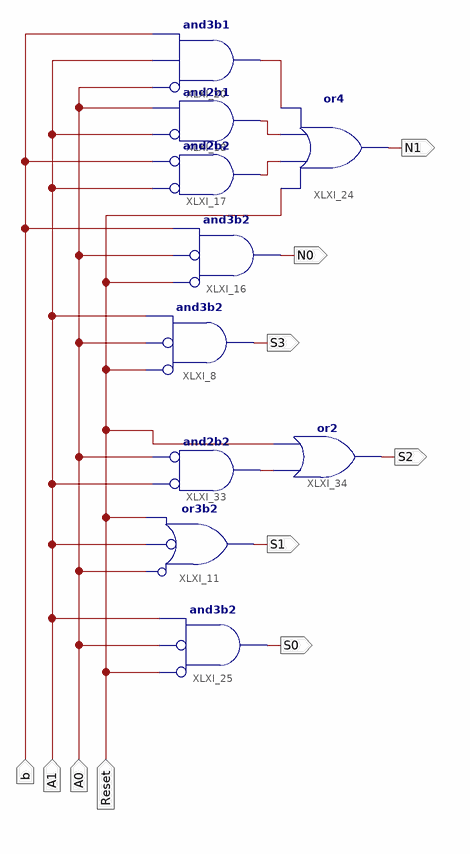
[diagram p0: schematic sheet 1]
// Xilinx ISE schematic example.sch (spartan3e) as structural Verilog: 10 symbols, 10 ports
module example (
  input  A1,
  input  A0,
  input  b,
  input  Reset,
  output S3,
  output N0,
  output N1,
  output S1,
  output S0,
  output S2
);

  wire XLXN_43, XLXN_44, XLXN_45, XLXN_63;

  and XLXI_8 (S3, ~Reset, ~A0, A1);  // and3b2
  and XLXI_16 (N0, ~Reset, ~A0, b);  // and3b2
  and XLXI_18 (XLXN_44, ~A1, A0);  // and2b1
  and XLXI_20 (XLXN_43, ~A0, A1, b);  // and3b1
  and XLXI_17 (XLXN_45, ~A1, ~b);  // and2b2
  or XLXI_24 (N1, Reset, XLXN_45, XLXN_44, XLXN_43);
  and XLXI_25 (S0, ~Reset, ~A0, A1);  // and3b2
  or XLXI_11 (S1, ~A0, ~A1, Reset);  // or3b2
  and XLXI_33 (XLXN_63, ~A1, ~A0);  // and2b2
  or XLXI_34 (S2, XLXN_63, Reset);
endmodule
